# EAGLE design HARPY_SMD (EAGLE 6.2)
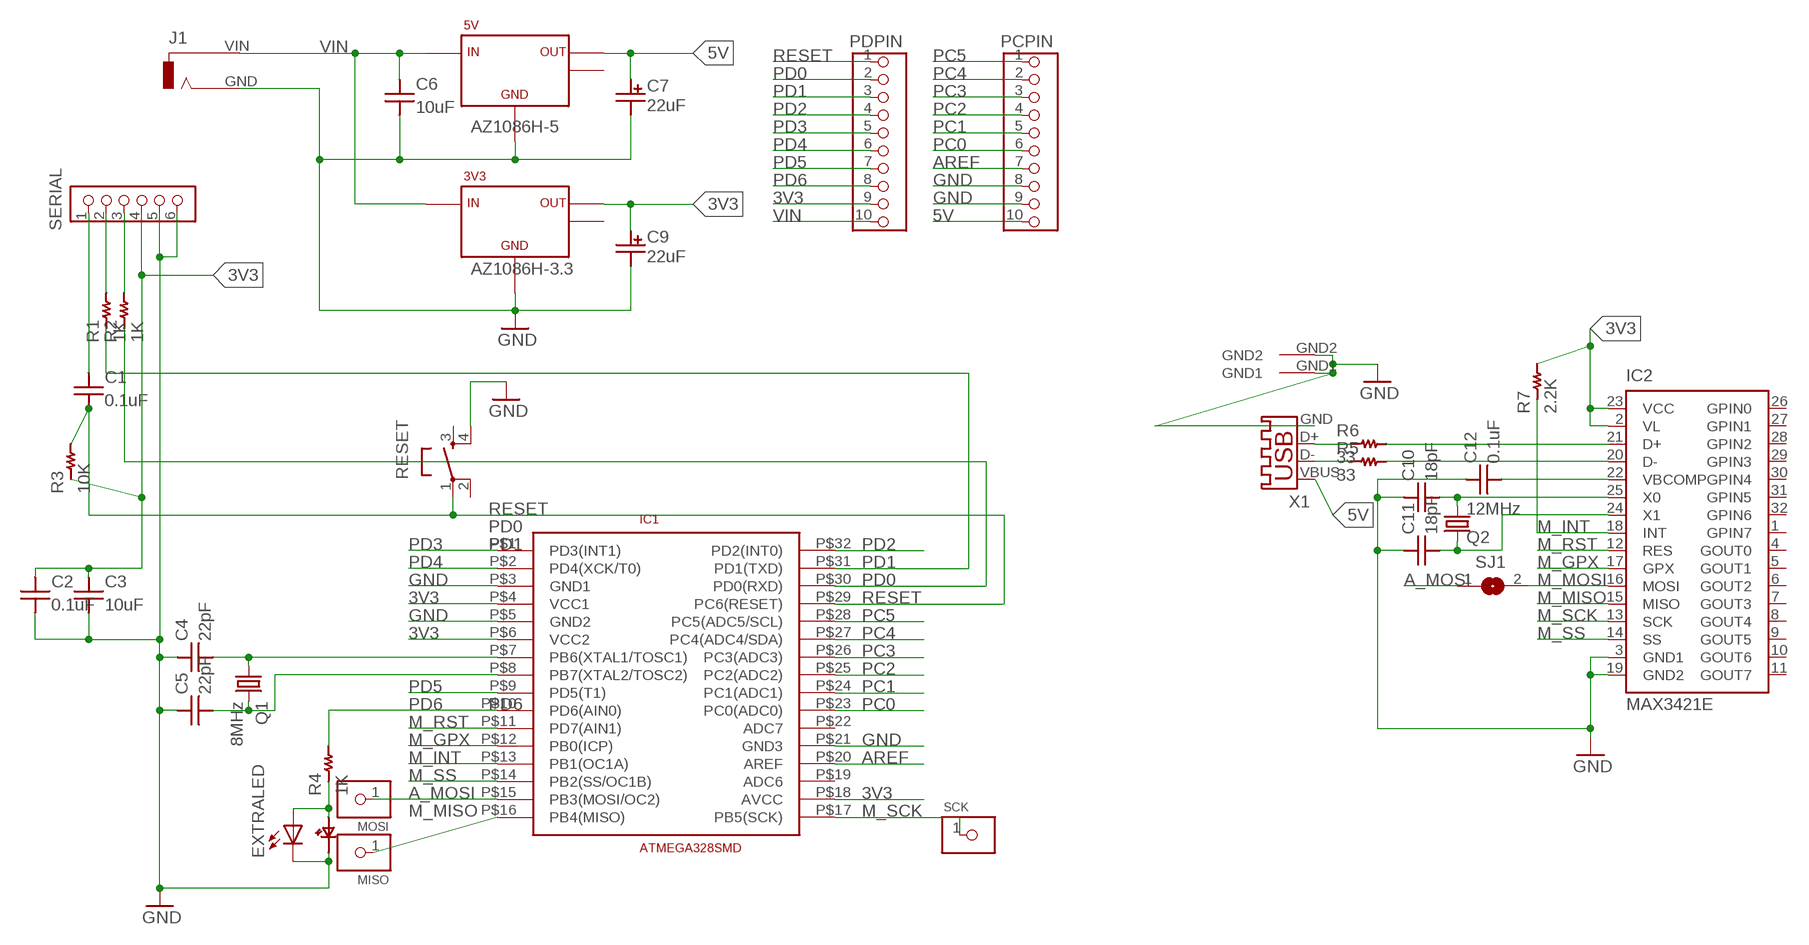
[diagram p0: schematic, sheet 1]

## Parts
3V3  AZ1086H  [AZ1086H]
5V  AZ1086H  [AZ1086H]
C1  0.1uF  C_SMD2012  [SMD_2012_0805]
C2  0.1uF  C_SMD2012  [SMD_2012_0805]
C3  10uF  C_SMD2012  [SMD_2012_0805]
C4  22pF  C_SMD2012  [SMD_2012_0805]
C5  22pF  C_SMD2012  [SMD_2012_0805]
C6  10uF  C_SMD3216  [SMD_3216_1206]
C7  22uF  C_SMD_POL3528  [SMD_3528]
C9  22uF  C_SMD_POL3528  [SMD_3528]
C10  18pF  C_SMD2012  [SMD_2012_0805]
C11  18pF  C_SMD2012  [SMD_2012_0805]
C12  0.1uF  C_SMD2012  [SMD_2012_0805]
EXTRALED  LED3MM  [LED3MM]
IC1  ATMEGA328SMD  [ATMEGA328SMD]
IC2  MAX3421E  2064VET44  [TQFP44]
J1  DCJ0303  [DCJ0303]
LED  LED1608  [SMD_1608_0603]
MISO  1X0108S  [1X01_0.8_UNSIGNED_SQUARE]
MOSI  1X0108S  [1X01_0.8_UNSIGNED_SQUARE]
PCPIN  1X10  [1X10_1.1_UNSIGNED]
PDPIN  1X10  [1X10_1.1_UNSIGNED]
Q1  8MHz  CRYSTALHC49U-V  [HC49U-V]
Q2  12MHz  CRYSTALHC49U-V  [HC49U-V]
R1  1K  R_SMD2012  [SMD_2012_0805]
R2  1K  R_SMD2012  [SMD_2012_0805]
R3  10K  R_SMD2012  [SMD_2012_0805]
R4  1K  R_SMD2012  [SMD_2012_0805]
R5  33  R_SMD2012  [SMD_2012_0805]
R6  33  R_SMD2012  [SMD_2012_0805]
R7  2.2K  R_SMD2012  [SMD_2012_0805]
RESET  10-XXAKI  [TSKB-2JL]
SCK  1X0108S  [1X01_0.8_UNSIGNED_SQUARE]
SERIAL  1X06A  [1X06_1.1_ARROW]
SJ1  SJ  [SJ]
X1  USB-A003  [USB-A003]

## Nets
3V3 [3V3]: 3V3.OUTPUT1 C2.P$1 C3.P$1 C9.P$1(+) IC1.P$4(VCC1) IC1.P$6(VCC2) IC1.P$18(AVCC) IC2.2(VL) IC2.23(VCC) PDPIN.9 R3.P$1 R7.P$2 SERIAL.4
5V [5V]: 5V.OUTPUT1 C7.P$1(+) PCPIN.10 X1.VBUS
A_MOSI: IC1.P$15(PB3(MOSI/OC2)) MOSI.1 SJ1.1
AREF [3V3]: IC1.P$20(AREF) PCPIN.7
GND: 3V3.GND 5V.GND C2.P$2 C3.P$2 C4.P$1 C5.P$1 C6.P$2 C7.P$2(-) C9.P$2(-) C10.P$1 C11.P$1 C12.P$1 EXTRALED.K(C) IC1.P$3(GND1) IC1.P$5(GND2) IC1.P$21(GND3) IC2.3(GND1) IC2.19(GND2) J1.GND LED.P$2(C) PCPIN.8 PCPIN.9 RESET.4(S1) SERIAL.5 SERIAL.6 X1.GND X1.GND1 X1.GND2
M_GPX: IC1.P$12(PB0(ICP)) IC2.17(GPX)
M_INT: IC1.P$13(PB1(OC1A)) IC2.18(INT) R7.P$1
M_MISO: IC1.P$16(PB4(MISO)) IC2.15(MISO) MISO.1
M_MOSI: IC2.16(MOSI) SJ1.2
M_RST: IC1.P$11(PD7(AIN1)) IC2.12(RES)
M_SCK: IC1.P$17(PB5(SCK)) IC2.13(SCK) SCK.1
M_SS: IC1.P$14(PB2(SS/OC1B)) IC2.14(SS)
N$1: C1.P$1 SERIAL.1
N$2: R1.P$2 SERIAL.2
N$3: R2.P$2 SERIAL.3
N$4: EXTRALED.A LED.P$1(A) R4.P$1
N$8: C4.P$2 IC1.P$7(PB6(XTAL1/TOSC1)) Q1.1
N$12: C5.P$2 IC1.P$8(PB7(XTAL2/TOSC2)) Q1.2
N$28: R6.P$1 X1.D+
N$29: R5.P$1 X1.D-
N$30: IC2.21(D+) R6.P$2
N$31: IC2.20(D-) R5.P$2
N$33: C10.P$2 IC2.25(X0) Q2.1
N$34: C11.P$2 IC2.24(X1) Q2.2
N$35: C12.P$2 IC2.22(VBCOMP)
PC0: IC1.P$23(PC0(ADC0)) PCPIN.6
PC1: IC1.P$24(PC1(ADC1)) PCPIN.5
PC2: IC1.P$25(PC2(ADC2)) PCPIN.4
PC3: IC1.P$26(PC3(ADC3)) PCPIN.3
PC4: IC1.P$27(PC4(ADC4/SDA)) PCPIN.2
PC5: IC1.P$28(PC5(ADC5/SCL)) PCPIN.1
PD0: IC1.P$30(PD0(RXD)) PDPIN.2 R2.P$1
PD1: IC1.P$31(PD1(TXD)) PDPIN.3 R1.P$1
PD2: IC1.P$32(PD2(INT0)) PDPIN.4
PD3: IC1.P$1(PD3(INT1)) PDPIN.5
PD4: IC1.P$2(PD4(XCK/T0)) PDPIN.6
PD5: IC1.P$9(PD5(T1)) PDPIN.7
PD6: IC1.P$10(PD6(AIN0)) PDPIN.8 R4.P$2
RESET: C1.P$2 IC1.P$29(PC6(RESET)) PDPIN.1 R3.P$2 RESET.1(P)
VIN [VIN]: 3V3.INPUT 5V.INPUT C6.P$1 J1.VIN PDPIN.10
Unconnected: 3V3.OUTPUT2 5V.OUTPUT2 IC1.P$19(ADC6) IC1.P$22(ADC7) IC2.1(GPIN7) IC2.4(GOUT0) IC2.5(GOUT1) IC2.6(GOUT2) IC2.7(GOUT3) IC2.8(GOUT4) IC2.9(GOUT5) IC2.10(GOUT6) IC2.11(GOUT7) IC2.26(GPIN0) IC2.27(GPIN1) IC2.28(GPIN2) IC2.29(GPIN3) IC2.30(GPIN4) IC2.31(GPIN5) IC2.32(GPIN6) RESET.2(P1) RESET.3(S)

## Notes on the sheet
- AZ1086H-5
- AZ1086H-3.3

## Library data of the parts
3V3 5V = AZ1086H:AZ1086H
C1-C6 C10-C12 = SMD:C_SMD
C7 C9 = SMD:C_SMD_POL
EXTRALED = led:LED: LED OSRAM: - CHIPLED LG R971, LG N971, LY N971, LG Q971, LY Q971, LO R971, LY R971 LH N974, LH R974 LS Q976, LO Q976, LY Q976 LO Q996 - Hyper CHIPLED LW Q18S LB Q993, LB Q99A, LB R99A - SideLED LS A670, LO A670, LY A670, LG A670, LP A670 LB A673, LV A673, LT A673, LW A673 LH A674 LY A675 LS A676, LA A676, LO A676, LY A676, LW A676 LS A679, LY A679, LG A679 - Hyper Micro SIDELED® LS Y876, LA Y876, LO Y876, LY Y876 LT Y87S - SmartLED LW L88C, LW L88S LB L89C, LB L89S, LG L890 LS L89K, LO L89K, LY L89K LS L896, LA L896, LO L896, LY L896 - TOPLED LS T670, LO T670, LY T670, LG T670, LP T670 LSG T670, LSP T670, LSY T670, LOP T670, LYG T670 LG T671, LOG T671, LSG T671 LB T673, LV T673, LT T673, LW T673 LH T674 LS T676, LA T676, LO T676, LY T676, LB T676, LH T676, LSB T676, LW T676 LB T67C, LV T67C, LT T67C, LS T67K, LO T67K, LY T67K, LW E67C LS E67B, LA E67B, LO E67B, LY E67B, LB E67C, LV E67C, LT E67C LW T67C LS T679, LY T679, LG T679 LS T770, LO T770, LY T770, LG T770, LP T770 LB T773, LV T773, LT T773, LW T773 LH T774 LS E675, LA E675, LY E675, LS T675 LS T776, LA T776, LO T776, LY T776, LB T776 LHGB T686 LT T68C, LB T68C - Hyper Mini TOPLED® LB M676 - Mini TOPLED Santana® LG M470 LS M47K, LO M47K, LY M47K Source: http://www.osram.convergy.de LUXEON: - LUMILED® LXK2-PW12-R00, LXK2-PW12-S00, LXK2-PW14-U00, LXK2-PW14-V00 LXK2-PM12-R00, LXK2-PM12-S00, LXK2-PM14-U00 LXK2-PE12-Q00, LXK2-PE12-R00, LXK2-PE12-S00, LXK2-PE14-T00, LXK2-PE14-U00 LXK2-PB12-K00, LXK2-PB12-L00, LXK2-PB12-M00, LXK2-PB14-N00, LXK2-PB14-P00, LXK2-PB14-Q00 LXK2-PR12-L00, LXK2-PR12-M00, LXK2-PR14-Q00, LXK2-PR14-R00 LXK2-PD12-Q00, LXK2-PD12-R00, LXK2-PD12-S00 LXK2-PH12-R00, LXK2-PH12-S00 LXK2-PL12-P00, LXK2-PL12-Q00, LXK2-PL12-R00 Source: www.luxeon.com KINGBRIGHT: KA-3528ASYC Source: www.kingbright.com
IC1 = ATmega328:ATMEGA328SMD
IC2 = MAX3421E:2064VET44: LATTICE PROGRAMMABLE DEVICE Source: http://www.latticesemi.com/lit/docs/datasheets/cpld/2064v.pdf / 2064ve.pdf; OC_FARNELL: unknown; OC_NEWARK: unknown
J1 = JACK_NOBGND:DCJ0303: DC POWER JACK Source: DCJ0303.pdf; OC_FARNELL: unknown; OC_NEWARK: unknown
LED = SMD:LED
MISO MOSI SCK = PIN:1X01
PCPIN PDPIN = PIN:1X10
Q1 Q2 = crystal:CRYSTAL: CRYSTAL; OC_FARNELL: 1666969; OC_NEWARK: unknown
R1-R7 = SMD:R_SMD
RESET = TACT:10-XX: OMRON SWITCH
SERIAL = PIN:1X06
SJ1 = jumper:SJ: SMD solder JUMPER
X1 = USB_FEMALE:USB-A003: USB connector; OC_FARNELL: unknown; OC_NEWARK: unknown

## Net classes
1 VIN: width 0.406 mm
2 5V: width 0.254 mm
3 3V3: width 0.203 mm

## Board
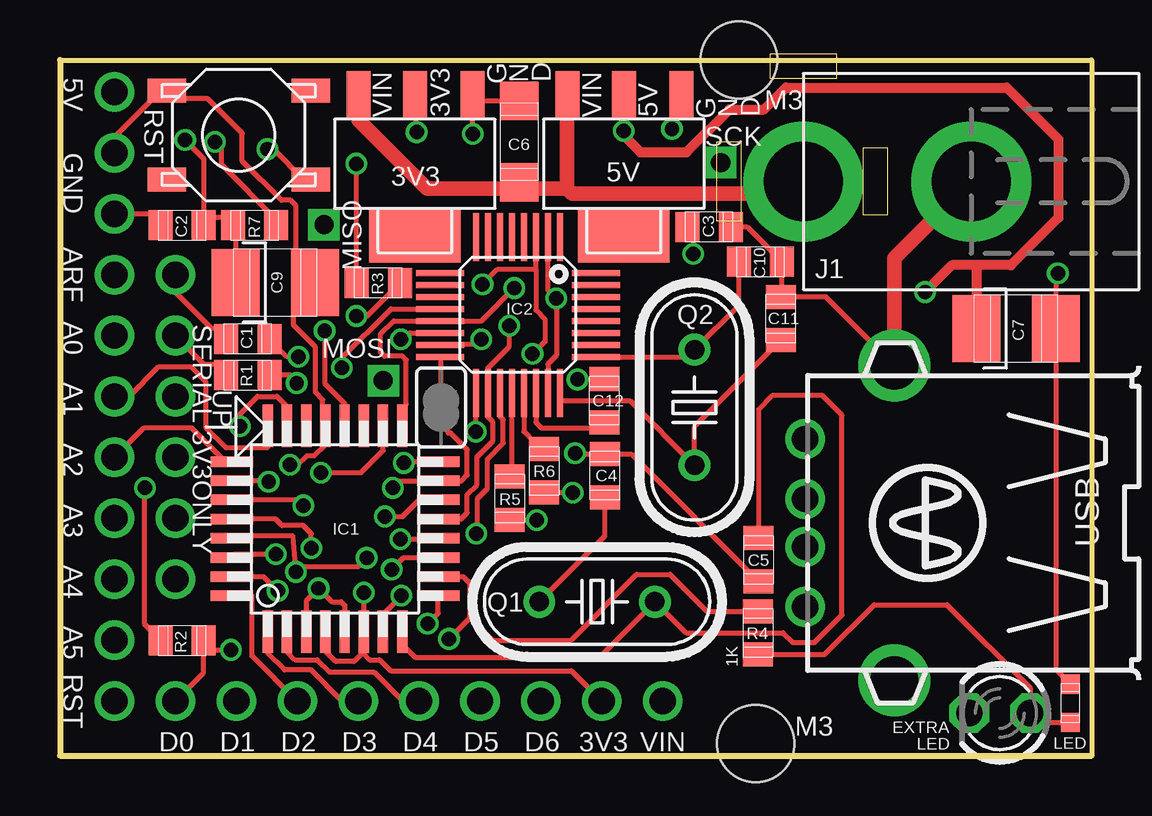
[diagram p1: board, top side]
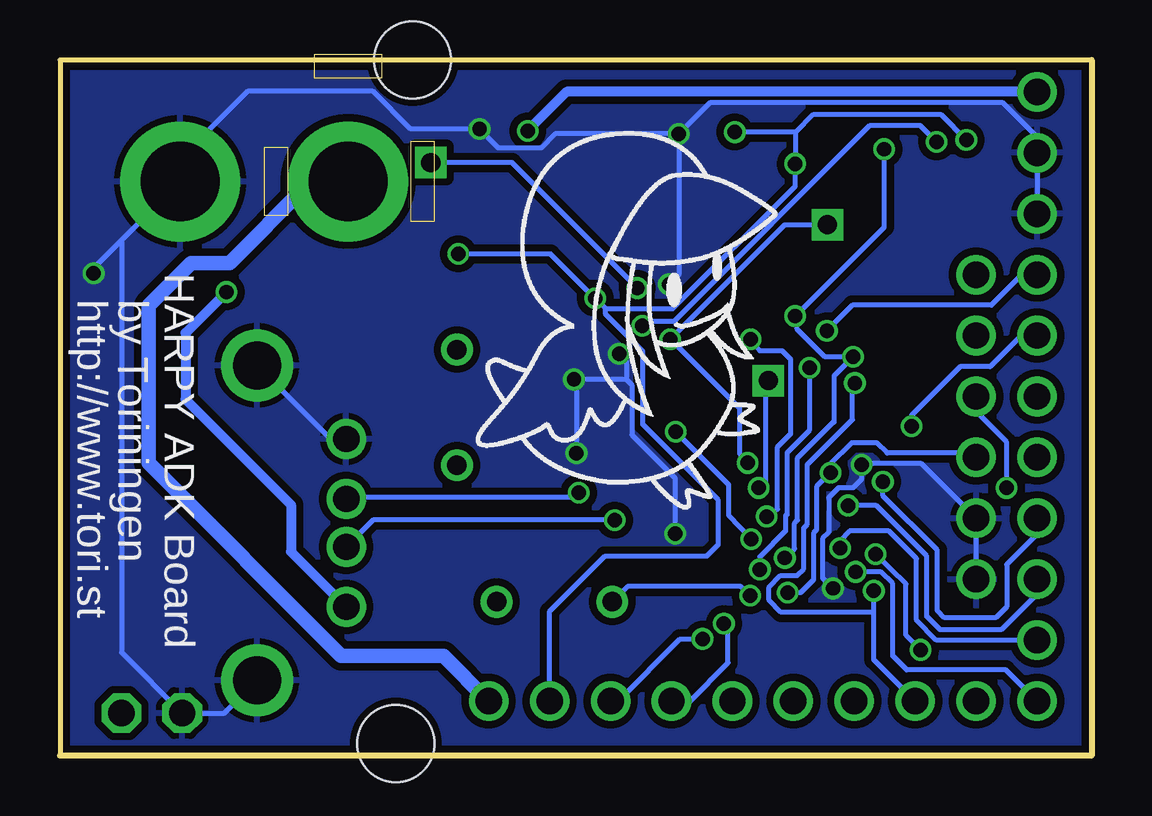
[diagram p2: board, bottom side, seen from below]

Size 43 x 29 mm. Coordinates in mm from the lower left corner, seen from the top.
Outline: 0,0 43,0 43,29 0,29 0,0
Copper layers (1*16): Top 0.035mm / dielectric 1.5mm / Bottom 0.035mm
Design rules: minimum track width 6mil, minimum drill 12mil, track to track 6mil, track to pad 6mil, pad to pad 6mil, via to via 6mil, smd to smd 0mil, copper to edge 10mil, drill to drill 10mil, minimum pad ring 10mil, minimum via ring 6mil, stop-mask expansion 2mil, vias tented up to drill 100mil, thermal gap 10mil
Holes 3.2 mm at 29,0.5 28.3,29

### Footprints (pad centres in the part's own frame; a part is rotated, then mirrored left to right if it is on the bottom)
AZ1086H = smd 1 x 2: GND -2.4,-2.85; INPUT 2.35,-2.85; OUTPUT1 0,-2.85 | smd 3.81 x 2.286: OUTPUT2 0,2.972
SMD_2012_0805 = smd 1 x 1.25: P$1 -0.9,0; P$2 0.9,0
SMD_3216_1206 = smd 1.6 x 1.6: P$1 -1.7,0; P$2 1.7,0
SMD_3528 = smd 2 x 2.8: P$1 -1.65,0; P$2 1.65,0
LED3MM = drill 1.1 octagon: A -1.27,0; K 1.27,0
ATMEGA328SMD = smd 1.77 x 0.435: P$1 -4.3,2.8; P$2 -4.3,2; P$3 -4.3,1.2; P$4 -4.3,0.4; P$5 -4.3,-0.4; P$6 -4.3,-1.2; P$7 -4.3,-2; P$8 -4.3,-2.8; P$17 4.3,-2.8; P$18 4.3,-2; P$19 4.3,-1.2; P$20 4.3,-0.4; P$21 4.3,0.4; P$22 4.3,1.2; P$23 4.3,2; P$24 4.3,2.8 | smd 0.435 x 1.77: P$9 -2.8,-4.3; P$10 -2,-4.3; P$11 -1.2,-4.3; P$12 -0.4,-4.3; P$13 0.4,-4.3; P$14 1.2,-4.3; P$15 2,-4.3; P$16 2.8,-4.3; P$25 2.8,4.3; P$26 2,4.3; P$27 1.2,4.3; P$28 0.4,4.3; P$29 -0.4,4.3; P$30 -1.2,4.3; P$31 -2,4.3; P$32 -2.8,4.3
TQFP44 = smd 2 x 0.25: 1 -3.25,1.75; 2 -3.25,1.25; 3 -3.25,0.75; 4 -3.25,0.25; 5 -3.25,-0.25; 6 -3.25,-0.75; 7 -3.25,-1.25; 8 -3.25,-1.75; 17 3.25,-1.75; 18 3.25,-1.25; 19 3.25,-0.75; 20 3.25,-0.25; 21 3.25,0.25; 22 3.25,0.75; 23 3.25,1.25; 24 3.25,1.75 | smd 0.25 x 2: 9 -1.75,-3.25; 10 -1.25,-3.25; 11 -0.75,-3.25; 12 -0.25,-3.25; 13 0.25,-3.25; 14 0.75,-3.25; 15 1.25,-3.25; 16 1.75,-3.25; 25 1.75,3.25; 26 1.25,3.25; 27 0.75,3.25; 28 0.25,3.25; 29 -0.25,3.25; 30 -0.75,3.25; 31 -1.25,3.25; 32 -1.75,3.25
DCJ0303 = drill 3.3 pad 5: GND 0,-7; VIN 0,0
SMD_1608_0603 = smd 0.8 x 0.8: P$1 -0.8,0; P$2 0.8,0
1X01_0.8_UNSIGNED_SQUARE = drill 0.8 square: 1 0,0
1X10_1.1_UNSIGNED = drill 1.1: 1 -11.43,0; 2 -8.89,0; 3 -6.35,0; 4 -3.81,0; 5 -1.27,0; 6 1.27,0; 7 3.81,0; 8 6.35,0; 9 8.89,0; 10 11.43,0
HC49U-V@1 = drill 0.813: 1 -2.413,0; 2 2.413,0
TSKB-2JL = smd 1.6 x 1: 1 -3,1.85; 2 3,1.85; 3 -3,-1.85; 4 3,-1.85
1X06_1.1_ARROW = drill 1.1: 1 -6.35,0; 2 -3.81,0; 3 -1.27,0; 4 1.27,0; 5 3.81,0; 6 6.35,0
SJ = smd 0.6 x 1.3: 1 -0.4,0; 2 0.4,0
USB-A003 = drill 1.1: D+ 1,14; D- -1,14; GND 3.5,14; VBUS -3.5,14 | drill 2: GND1 -6.57,10.28; GND2 6.57,10.28

### Placement (x,y rotation side)
3V3  14.79,24.67 180 top
5V  23.5,24.67 180 top
C1  7.83,17.36 0 top
C2  5.09,22.11 180 top
C3  27.06,22.03 0 top
C4  22.72,11.67 270 top
C5  29.12,8.16 90 top
C6  19.15,25.6 90 top
C7  39.85,17.8 0 top
C9  8.98,19.72 0 top
C10  29.19,20.58 180 top
C11  30.06,18.22 270 top
C12  22.69,14.79 270 top
EXTRALED  39.17,1.77 180 top
IC1  11.46,9.46 90 top
IC2  19.08,18.37 270 top
J1  30.99,23.93 90 top
LED  42.11,2.18 90 top
MISO  11.01,22.13 0 top
MOSI  13.47,15.63 0 top
PCPIN  2.27,16.24 90 top
PDPIN  13.7,2.27 0 top
Q1  8MHz  [HC49U-V@1]  22.39,6.41 0 top
Q2  12MHz  [HC49U-V@1]  26.45,14.51 270 top
R1  7.83,15.86 180 top
R2  5.09,4.81 180 top
R3  13.27,19.69 0 top
R4  29.09,5.11 90 top
R5  18.73,10.73 90 top
R6  20.18,11.87 90 top
R7  8.11,22.11 180 top
RESET  7.45,25.87 180 top
SCK  27.54,24.72 0 top
SERIAL  4.81,13.7 270 top
SJ1  15.88,14.51 90 top
U$1  [LOLI_BNAMES_0.5]  13,10 0 top
X1  45.07,9.7 90 top

### Tracks (layer width: path | path; a pad name or v marks a point on that pad's centre or on a via)
3V3  (via drill 0.6)
  Top 0.203: IC1.P$4 11.06,4.35 11.49,3.92 12.25,3.92 12.61,4.28 | 12.61,4.28 12.61,5.1 IC1.P$6 v12.66,6.79 | 12.61,4.28 12.89,4 13.32,4 13.78,3.54 21.32,3.54 PDPIN.9 | IC1.P$18 13.47,12.71 12.56,11.79 v10.88,11.79 | C9.P$1 7.33,21.98 7.45,22.11 R7.P$2 7.21,22.45 6.33,22.45 C2.P$1 5.99,24.89 v5.22,25.66 | v14.87,25.99 3V3.OUTPUT1 | C3.P$1 26.4,21.79 v26.4,20.91 | IC2.2 20.34,19.41 v20.69,19.06 20.69,16.68 20.34,16.32 IC2.23 | R3.P$1 12.35,19.71 v12.35,24.67
  Bottom 0.203: v12.66,6.79 12.12,6.79 11.59,7.33 11.59,9.28 11.46,9.41 11.46,11.21 v10.88,11.79 10.88,12.15 9.99,13.04 8.95,13.04 8.52,12.61 4.99,12.61 SERIAL.4 | 12.33,25.99 v14.87,25.99 | v26.4,20.91 22.55,20.91 v20.69,19.06 20.26,18.63 | 12.33,25.99 12.33,24.67 v12.35,24.67 12.35,23.73 17.46,18.63 20.26,18.63 | PDPIN.9 22.59,6 20.28,8.31 16.04,8.31 15.55,8.8 15.55,10.65 18.7,13.8 18.7,16.85 20.26,18.4 20.26,18.63 | 12.33,25.99 11.59,26.73 6.28,26.73 v5.22,25.66
5V  (via drill 0.6)
  Top 0.406: 23.38,28.03 23.5,27.9 5V.OUTPUT1 v23.5,26.04 23.5,25.84 24.19,25.16 26.12,25.16 27.9,26.93 29.35,26.93 30.26,27.85 39.46,27.85 41.62,25.69 41.62,22.42 39.64,20.44 38.27,20.44 | 38.3,17.29 38.38,17.38 C7.P$1 38.2,20.37 38.27,20.44 | 38.27,20.44 37.18,20.44 v36.06,19.32
  Bottom 0.406: v23.5,26.04 21.88,27.67 PCPIN.10 | v36.06,19.32 37.76,17.62 37.76,14.85 33.37,10.46 33.37,8.5 X1.VBUS
A_MOSI  (via drill 0.6)
  Top 0.203: 16.14,13.75 SJ1.1 16.19,13.45 16.29,13.45 16.98,12.76 16.98,11.69 16.74,11.46 IC1.P$15 15.78,11.44 14.16,11.44 v13.88,11.16
  Bottom 0.203: v13.88,11.16 13.57,11.46 13.57,15.53 MOSI.1
AREF  (via drill 0.6)
  Top 0.203: IC1.P$20 11.87,14.67 11.03,15.5 v11.03,17.71
  Bottom 0.203: PCPIN.7 2.9,20.05 4.17,18.78 9.97,18.78 v11.03,17.71
GND  (via drill 0.6)
  Top 0.203: IC1.P$21 11.08,13.74 | IC2.3 | IC2.19 18.34,14.14 18.48,14.01 18.48,13.01 17.82,12.35 17.82,11.13 17.41,10.73 17.41,9.31 v17.36,9.26 | C9.P$2 10.78,19.69 | IC1.P$21 11.06,14.18 10.96,14.28 10.96,14.84 10.65,15.15 10.65,17.03 9.74,17.94 9.74,18.68 10.63,19.57 C9.P$2 | C2.P$2 3.71,22.59 PCPIN.8 | C6.P$2 17.42,27.3 3V3.GND 17.19,25.92 v17.2,25.92 | IC2.3 19.85,21.61 | v21.57,15.68 C12.P$1 | C3.P$2 28.65,22.03 C10.P$1 30.09,19.16 C11.P$1 31.94,19.12 X1.GND2 | C4.P$1 21.51,12.57 v21.47,12.61 | C4.P$1 22.72,12.53 | C5.P$1 23.81,12.57 C4.P$1 | v19.69,16.75 20.23,17.26 20.23,18.17 19.84,18.56 19.84,20.28 | 19.84,20.28 IC2.3 | IC1.P$21 11.06,12.97 10.6,12.51 10.3,12.51 9.91,12.12 v9.59,12.12 | v17.61,19.64 18.25,20.28 19.84,20.28 | 10.35,19.72 10.12,19.95 10.19,20.02 10.19,20.15 | C9.P$2 10.19,20.15 | 10.19,20.15 10.12,20.23 | PCPIN.9 2.27,25.79 4.2,27.72 RESET.4 4.64,27.72 4.96,27.39 6.16,27.39 7.6,25.94 7.6,24.77 9.23,23.15 9.61,23.15 9.84,22.92 9.84,19.34 10.25,19.34 C9.P$2 | 5V.GND 25.51,27.13 v25.51,26.12 | IC1.P$3 10.27,6.46 v10.78,6.97 11.34,6.41 11.72,6.41 11.87,6.26 IC1.P$5 | v41.6,20.11 41.5,20.01 C7.P$2 41.5,3.59 LED.P$2
  Top 0.406: C7.P$2 41.06,18.24
  Top 0.61: X1.GND2 34.79,20.73 J1.GND
  Bottom 0.203: v10.78,6.97 11.21,7.4 11.21,9.05 10.96,9.31 10.96,10.75 10.55,11.16 9.94,11.16 9.59,11.52 v9.59,12.12 9.53,12.18 7.1,12.18 SERIAL.5 SERIAL.6 | v17.2,25.92 22.36,25.92 22.95,25.33 24.72,25.33 v25.51,26.12 28.38,26.12 29.96,27.7 35.17,27.7 37.99,24.88 J1.GND 40.43,21.49 | X1.GND 31.72,13.2 X1.GND2 | v17.36,9.26 17.36,11.57 19.16,13.37 19.16,15.45 19.39,15.68 | 19.39,15.68 v21.57,15.68 21.47,15.58 v21.47,12.61 | 19.39,15.68 19.39,16.44 v19.69,16.75 19.82,16.88 | v17.2,25.92 17.2,20.05 v17.61,19.64 | PCPIN.8 PCPIN.9 2.27,25.79 3.69,27.21 15.91,27.21 v17.2,25.92 | X1.GND1 36.15,1.77 EXTRALED.K 40.43,4.29 40.43,21.49 | 40.43,21.49 41.6,20.32 v41.6,20.11
  pour Bottom (isolate 0.305): -0.5,30 46.5,30 46.5,-0.5 -0.5,-0.5
M_GPX  (via drill 0.6)
  Top 0.203: IC2.17 v17.34,13.5 v17.33,13.5 | 15.77,9.05 IC1.P$12 15.73,9.03 v14.18,9.03
  Bottom 0.203: v17.33,13.5 15.12,11.29 15.12,10.02 v14.18,9.03
M_INT  (via drill 0.6)
  Top 0.203: IC2.18 17.84,14.11 18.04,13.9 18.04,13.12 17.38,12.46 17.38,11.29 16.98,10.88 16.98,10.12 16.72,9.86 IC1.P$13 | 17.87,15.99 17.84,15.96 IC2.18 | R7.P$1 9.01,22.25 | v18.73,17.92 18.73,17.05 17.84,16.16 IC2.18 | R7.P$1 9.03,22.12 | R7.P$1 9.1,22.2 | R7.P$1 9.01,22.35 6.71,24.65 6.71,25.33 v6.46,25.59
  Bottom 0.203: v18.73,17.92 18.53,18.12 17.38,18.12 9.23,26.27 7.15,26.27 v6.46,25.59
M_MISO  (via drill 0.6)
  Top 0.203: IC2.15 17.33,17.13 v17.56,17.36 | v14.34,12.2 14.52,12.26 IC1.P$16
  Bottom 0.203: v14.34,12.2 14.44,12.2 14.66,12.58 14.66,14.46 v17.56,17.36 12.79,22.13 MISO.1
M_MOSI
  Top 0.203: SJ1.2 15.88,16.57 IC2.16
M_RST  (via drill 0.6)
  Top 0.203: IC2.12 13.8,18.62 11.74,16.57 v11.74,16.16 | v13.83,7.76 14.33,8.26 IC1.P$11
  Bottom 0.203: v13.83,7.76 13.83,8.29 12.76,9.36 12.76,9.99 12.68,10.07 12.68,12.63 11.74,13.57 v11.74,16.16
M_SCK  (via drill 0.6)
  Top 0.203: IC1.P$17 14.31,13.8 | IC1.P$17 14.21,13.81 | IC1.P$17 | v18.93,19.49 17.57,18.12 IC2.13 13.91,18.12 13.37,17.59 13.37,16.8 13.52,16.65 14.28,16.65 14.44,16.49 14.44,14.64 14.34,14.54 14.34,13.83 IC1.P$17 | IC1.P$17 14.39,13.88
  Bottom 0.203: v18.93,19.49 24.16,24.72 SCK.1
M_SS  (via drill 0.6)
  Top 0.203: IC2.14 14.58,17.62 v14.21,17.36 | IC1.P$14 14.98,10.66 14.28,9.97 v13.55,9.97
  Bottom 0.203: v13.55,9.97 13.39,9.97 13.09,10.27 13.09,12.86 12.53,13.42 12.53,16.52 12.89,16.88 13.83,16.88 v14.21,17.36
N$1
  Top 0.203: C1.P$1 6.47,17.82 6.31,17.82 4.81,19.31 SERIAL.1
N$2
  Top 0.203: SERIAL.2 6,16.32 6.54,16.32 6.93,15.94 R1.P$2
N$3  (via drill 0.6)
  Top 0.203: R2.P$2 3.54,5.46 v3.54,11.16
  Bottom 0.203: v3.54,11.16 3.54,13.06 4.81,14.34 SERIAL.3
N$4
  Top 0.203: 42.18,1.38 LED.P$1 40.83,1.38 EXTRALED.A 40.45,2.82 36.97,6.29 33.94,6.29 31.87,4.21 R4.P$1
N$8  (via drill 0.6)
  Top 0.203: IC1.P$7 13.46,5.9 v14.23,6.66 | C4.P$2 22.72,9.15 Q1.1
  Bottom 0.203: v14.23,6.66 14.61,7.04 19.34,7.04 Q1.1
N$12
  Top 0.203: IC1.P$8 14.27,4.7 14.34,4.63 14.34,4.56 14.79,4.1 22.49,4.1 Q1.2 26.09,5.12 26.1,5.12 30.14,5.12 30.55,4.72 31.45,4.72 32.6,5.86 32.6,14.19 31.79,15 29.68,15 29.12,14.44 C5.P$2 29.17,9.11
N$28  (via drill 0.6)
  Top 0.203: R6.P$1 21.36,10.97 v21.37,10.96
  Bottom 0.203: v21.37,10.96 21.57,10.75 31.01,10.75 X1.D+
N$29  (via drill 0.6)
  Top 0.203: R5.P$1 19.86,9.83 v19.87,9.81
  Bottom 0.203: v19.87,9.81 29.95,9.81 X1.D-
N$30
  Top 0.203: IC2.21 19.34,13.5 19.72,13.12 20.01,13.12 R6.P$2
N$31
  Top 0.203: IC2.20 18.84,11.9 R5.P$2
N$33
  Top 0.203: C10.P$2 28.29,18.77 Q2.1 26.15,16.62 IC2.25
N$34
  Top 0.203: C11.P$2 26.45,13.71 Q2.2 23.76,14.79 20.84,14.79 IC2.24
N$35
  Top 0.203: IC2.22 19.84,13.89 20.07,13.65 22.45,13.65 C12.P$2
PC0  (via drill 0.6)
  Top 0.203: IC1.P$23 9.46,14.56 9.05,14.97 8.24,14.97 7.5,14.23 v7.5,13.72
  Bottom 0.203: v7.5,13.72 7.5,14.18 5.47,16.21 4.23,16.21 2.93,17.51 PCPIN.6
PC1
  Top 0.203: IC1.P$24 8.66,12.86 8.64,12.84 6.92,12.84 6.08,13.68 6.08,15.58 5.45,16.21 4.12,16.21 2.88,14.97 PCPIN.5
PC2
  Top 0.203: IC1.P$25 6.89,12.26 5.47,13.68 3.52,13.68 PCPIN.4
PC3  (via drill 0.6)
  Top 0.203: v8.7,11.41 8.65,11.46 IC1.P$26
  Bottom 0.203: v8.7,11.41 8.7,10.83 6.44,8.57 6.44,6.05 6.13,5.75 4,5.75 3.54,6.21 3.54,7.96 2.27,9.23 PCPIN.3
PC4  (via drill 0.6)
  Top 0.203: v10.14,10.42 9.91,10.66 IC1.P$27
  Bottom 0.203: v10.14,10.42 8.98,10.42 6.87,8.31 6.87,5.8 6.31,5.24 3.77,5.24 2.27,6.74 PCPIN.2
PC5  (via drill 0.6)
  Top 0.203: v10.47,8.64 10.47,9.26 10.14,9.59 9.26,9.59 8.98,9.86 IC1.P$28
  Bottom 0.203: v10.47,8.64 10.47,8.98 10.09,9.36 8.44,9.36 7.3,8.21 7.3,5.65 6.46,4.81 PCPIN.1
PD0  (via drill 0.6)
  Top 0.203: v9,8.39 7.3,8.39 IC1.P$30 | v7.12,4.4 6.01,4.4 R2.P$1 5.99,3.45 PDPIN.2
  Bottom 0.203: v9,8.39 7.73,7.15 7.73,5.01 v7.12,4.4
PD1  (via drill 0.6)
  Top 0.203: v9.08,6.87 8.49,7.46 IC1.P$31 | R1.P$1 9.64,15.86 9.87,15.63 v9.87,15.53
  Bottom 0.203: 9.08,5.98 9.08,4 PDPIN.3 | 9.08,5.98 v9.08,6.87 | 9.08,5.98 12.94,5.98 13.45,6.49 13.45,7.02 12.96,7.5 12.28,7.5 12,7.78 12,9.48 11.85,9.64 11.85,12.12 9.97,14.01 9.97,15.43 v9.87,15.53
PD2
  Top 0.203: IC1.P$32 8.01,6.66 8.01,4.15 PDPIN.4
PD3
  Top 0.203: IC1.P$1 8.66,4.26 9.36,3.56 10.47,3.56 11.77,2.27 PDPIN.5
PD4
  Top 0.203: IC1.P$2 9.46,4.32 9.79,4 10.73,4 11.24,3.49 13.09,3.49 14.31,2.27 PDPIN.6
PD5  (via drill 0.6)
  Top 0.203: v15.33,5.5 15.77,5.93 IC1.P$9
  Bottom 0.203: v15.33,5.5 15.15,5.32 15.15,3.87 16.75,2.27 PDPIN.7
PD6  (via drill 0.6)
  Top 0.203: 15.86,7.55 IC1.P$10 16.82,7.46 17.1,7.17 17.1,5.75 | R4.P$2 26.97,6.01 25.43,7.55 24.04,7.55 21.3,4.81 18.04,4.81 17.1,5.75 | v16.21,4.86 17.1,5.75
  Bottom 0.203: PDPIN.8 19.75,2.27 17.15,4.86 v16.21,4.86
RESET  (via drill 0.6)
  Top 0.203: 7.17,9.05 IC1.P$29 7.81,9.06 7.91,9.15 9.71,9.15 v9.84,7.66 10.07,7.88 12.43,7.88 v12.79,8.24 | C1.P$2 9.47,16.62 v9.94,16.62 | v12.35,18.32 12.8,18.32 R3.P$2 | RESET.1 10.16,24.02 8.9,25.28 v8.64,25.28
  Bottom 0.203: v9.84,7.66 8.77,7.66 8.29,7.17 8.29,4.15 7.71,3.56 3.56,3.56 PDPIN.1 | 9.97,16.6 v9.94,16.62 11.11,16.62 12.28,17.79 12.28,18.25 v12.35,18.32 8.64,22.03 v8.64,25.28 | v12.79,8.24 12.76,8.24 12.38,8.62 12.38,9.69 12.25,9.81 12.25,12.4 10.75,13.9 10.73,13.9 10.73,15.83 9.97,16.6 | 9.97,16.6 9.91,16.6
VIN
  Top 0.61: 19.15,23.63 C6.P$1 | 21.14,23.63 19.15,23.63 | 5V.INPUT 21.14,23.63 | 19.15,23.63 15.3,23.63 12.44,26.49 3V3.INPUT | J1.VIN 30.49,23.44 21.34,23.44 21.14,23.63
  Bottom 0.61: J1.VIN 32.76,23.93 32.76,23.71 35.93,20.54 37.53,20.54 39.31,18.76 39.31,12.19 31.28,4.16 27.02,4.16 PDPIN.10

### Text on the board
tPlace: 5V | G | N | D | RST | VIN | 3V3 | VIN | 5V | G | N | D | M3 | GND | ARF | A0 | SERIAL 3V3ONLY | A1 | UP | A2 | A3 | IC1 | A4 | A5 | 1K | RST | M3 | EXTRA | D0 | D1 | D2 | D3 | D4 | D5 | D6 | 3V3 | VIN | LED
bNames: HARPY ADK Board | by Toriningen | http://www.tori.st